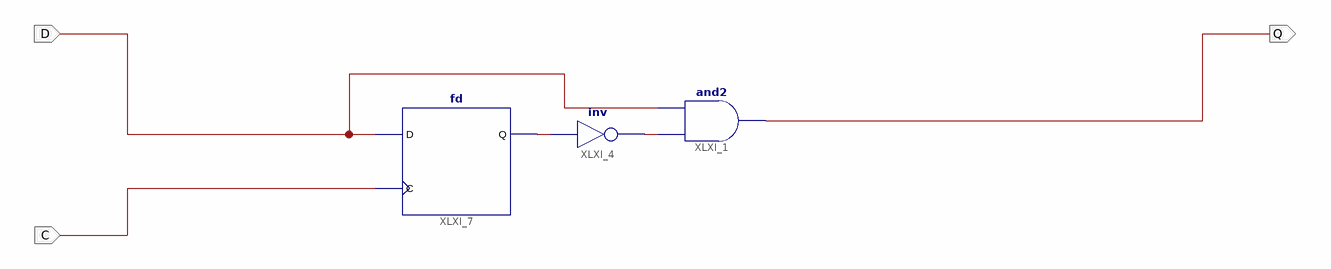
[diagram p0: schematic sheet 1]
// Xilinx ISE schematic RisingEdge.sch (artix7) as structural Verilog: 3 symbols, 3 ports
module RisingEdge (
  input  D,
  input  C,
  output Q
);

  wire XLXN_7, XLXN_9;

  and XLXI_1 (Q, XLXN_7, D);
  not XLXI_4 (XLXN_7, XLXN_9);
  fd XLXI_7 (.C(C), .D(D), .Q(XLXN_9));
endmodule
